# Altium project PCB_Project_1.PrjPcb
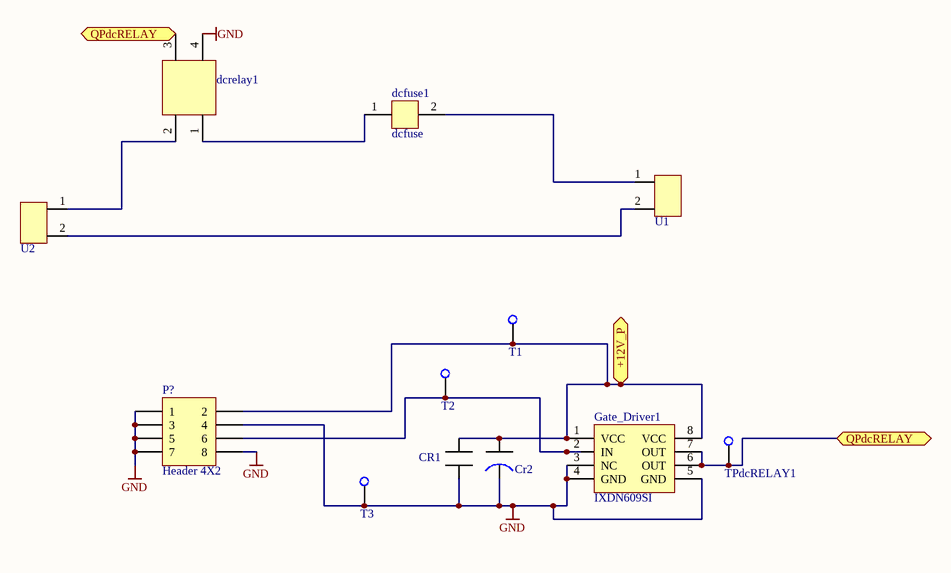
[diagram p0: Sheet1.SchDoc]
1 sheet, 12 parts. Net scope: flat (ports and power ports of the same name join across sheets).
Board file: dcrelay.PcbDoc

## Sheet Sheet1.SchDoc
size A

### Parts
CR1  100nF  [Cap_SMD]  (value not drawn)
Cr2  22uF  [Cap_tantalum]  (value not drawn)
dcfuse1  dcfuse  [dcf]
dcrelay1  dcrelay  [newdcrelay]  (value not drawn)
Gate_Driver1  IXDN609SI  [Gate driver _low side]
P1  Header 4X2  [HDR2X4]
T1  Test Point  [Test Point]  (value not drawn)
T2  Test Point  [Test Point]  (value not drawn)
T3  Test Point  [Test Point]  (value not drawn)
TPdcRELAY1  Test Point  [Test Point]  (value not drawn)
U1  Connector 60A  [newconn60A]  (value not drawn)
U2  Connector 60A  [newconn60A]  (value not drawn)

### Ports
+12V_P (bidir), QPdcRELAY (bidir)

### Nets
GND: CR1.2 Cr2.2 dcrelay1.4 Gate_Driver1.3(NC) Gate_Driver1.4(GND) Gate_Driver1.5(GND) P1.1 P1.3 P1.4 P1.5 P1.7 P1.8 T3.1(TP?)
NetCR1_1: CR1.1 Cr2.1 Gate_Driver1.1(VCC) Gate_Driver1.8(VCC) P1.2 T1.1(TP?) ; port +12V_P
Netdcfuse1_1: dcfuse1.1 dcrelay1.1
Netdcfuse1_2: dcfuse1.2 U1.1
Netdcrelay1_2: dcrelay1.2 U2.1
Netdcrelay1_3: dcrelay1.3 Gate_Driver1.6(OUT) Gate_Driver1.7(OUT) TPdcRELAY1.1(TP?) ; port QPdcRELAY
NetGate_Driver1_2: Gate_Driver1.2(IN) P1.6 T2.1(TP?)
NetU1_2: U1.2 U2.2

### Library data of the parts
CR1 = Cap_SMD
Cr2 = Cap_tantalum
Gate_Driver1 = Gate driver low side
P1 = Header 4X2: Header, 4-Pin, Dual row; LatestRevisionDate: 17-Jul-2002; LatestRevisionNote: Re-released for DXP Platform.; Publisher: Altium Limited